# Altium schematic sheet Power Supply.SchDoc
size A4
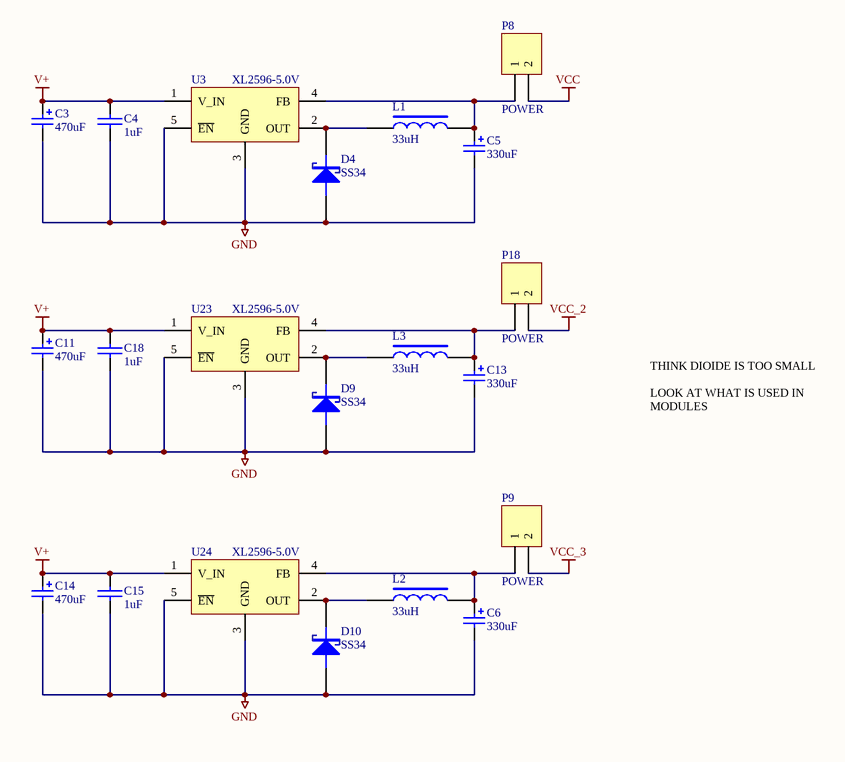
[diagram p0: Power Supply.SchDoc]

## Parts
C3  470uF  [CAP 10Dx16Hx5P]
C4  1uF  [CAP 1206]
C5  330uF  [CAP 10Dx16Hx5P]
C6  330uF  [CAP 10Dx16Hx5P]
C11  470uF  [CAP 10Dx16Hx5P]
C13  330uF  [CAP 10Dx16Hx5P]
C14  470uF  [CAP 10Dx16Hx5P]
C15  1uF  [CAP 1206]
C18  1uF  [CAP 1206]
D4  SS34  [DO-215AD (SOD123)]
D9  SS34  [DO-215AD (SOD123)]
D10  SS34  [DO-215AD (SOD123)]
L1  33uH  [12.3x12.3x6]
L2  33uH  [12.3x12.3x6]
L3  33uH  [12.3x12.3x6]
P8  POWER  [HEADER 1x2]
P9  POWER  [HEADER 1x2]
P18  POWER  [HEADER 1x2]
U3  XL2596-5.0V  [TO263-5]
U23  XL2596-5.0V  [TO263-5]
U24  XL2596-5.0V  [TO263-5]

## Nets
GND: C3.2 C4.2 C5.2 C6.2 C11.2 C13.2 C14.2 C15.2 C18.2 D4.1(A) D9.1(A) D10.1(A) U3.3(GND) U3.5(~{EN}) U23.3(GND) U23.5(~{EN}) U24.3(GND) U24.5(~{EN})
V+: C3.1 C4.1 C11.1 C14.1 C15.1 C18.1 U3.1(V_IN) U23.1(V_IN) U24.1(V_IN)
VCC: P8.2
VCC_2: P18.2
VCC_3: P9.2
NetC5_1: C5.1 L1.2 P8.1 U3.4(FB)
NetC6_1: C6.1 L2.2 P9.1 U24.4(FB)
NetC13_1: C13.1 L3.2 P18.1 U23.4(FB)
NetD4_2: D4.2(K) L1.1 U3.2(OUT)
NetD9_2: D9.2(K) L3.1 U23.2(OUT)
NetD10_2: D10.2(K) L2.1 U24.2(OUT)

## Notes on the sheet
- THINK DIOIDE IS TOO SMALL
  LOOK AT WHAT IS USED IN MODULES

## Library data of the parts
C3 C5 C6 C11 C13 C14 = Aluminum 10Dx16Hx5P: Polarized Capacitor (Radial); LCSC Part Number: C698136
  C3 C11 C14: Value: 470uF
  C5 C6 C13: Value: 330uF
C4 C15 C18 = CAP: CAPACITOR SMD 0603; value: 1uF; LCSC Part Number: C91151
D4 D9 D10 = DIODE: DIODE, POWER; Value: SS34; LCSC Part Number: C466502
L1-L3 = INDUCTOR SMD 1210 100uH: INDUCTOR SMD 1210; LCSC Part Number: C439422; Value: 33uH
P8 P9 P18 = Header 2: Header, 2-Pin; LatestRevisionDate: 17-Jul-2002; LatestRevisionNote: Re-released for DXP Platform.; Publisher: Altium Limited
U3 U23 U24 = XL2596 -5.0 REGLATOR: XL2596-5.0; Value: XL2596-5.0; LCSC Part Number: C74190